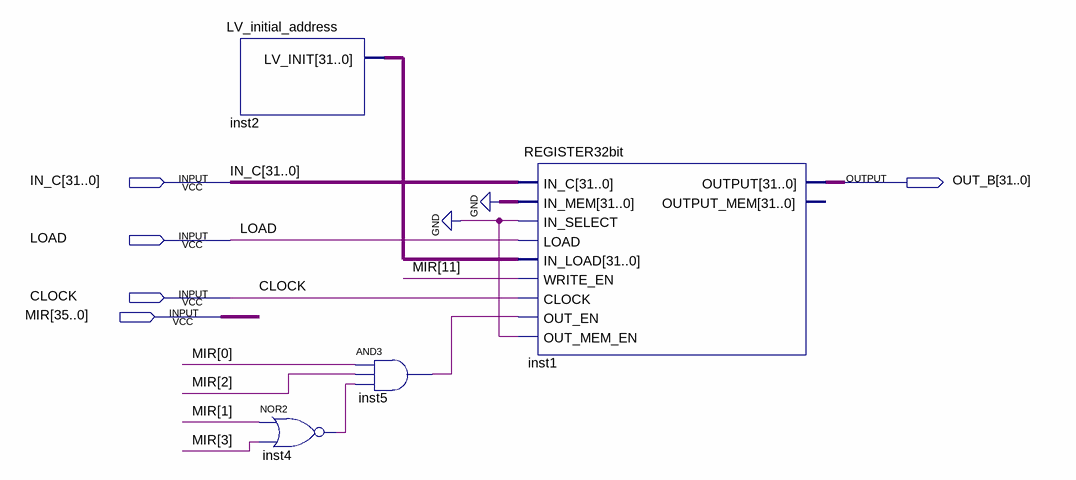
[diagram p0: schematic sheet]
// Quartus schematic LV.bdf as structural Verilog: 4 symbols, 5 pins
module LV (
  input  [31:0] IN_C,
  input  LOAD,
  input  CLOCK,
  input  [35:0] MIR,
  output [31:0] OUT_B
);

  wire inst4_out, inst5_out;
  wire [31:0] inst2_lv_init;

  LV_initial_address inst2 (.LV_INIT(inst2_lv_init));
  nor inst4 (inst4_out, MIR[1], MIR[3]);
  and inst5 (inst5_out, MIR[0], MIR[2], inst4_out);
  REGISTER32bit inst1 (
    .IN_C(IN_C), .IN_MEM({32{1'b0}}), .IN_SELECT(1'b0), .LOAD(LOAD), .IN_LOAD(inst2_lv_init),
    .WRITE_EN(MIR[11]), .CLOCK(CLOCK), .OUT_EN(inst5_out), .OUT_MEM_EN(1'b0), .OUTPUT(OUT_B));  // open: OUTPUT_MEM
endmodule
